# EAGLE schematic vref low current 20 vpp source v01 (EAGLE 7.7.0)
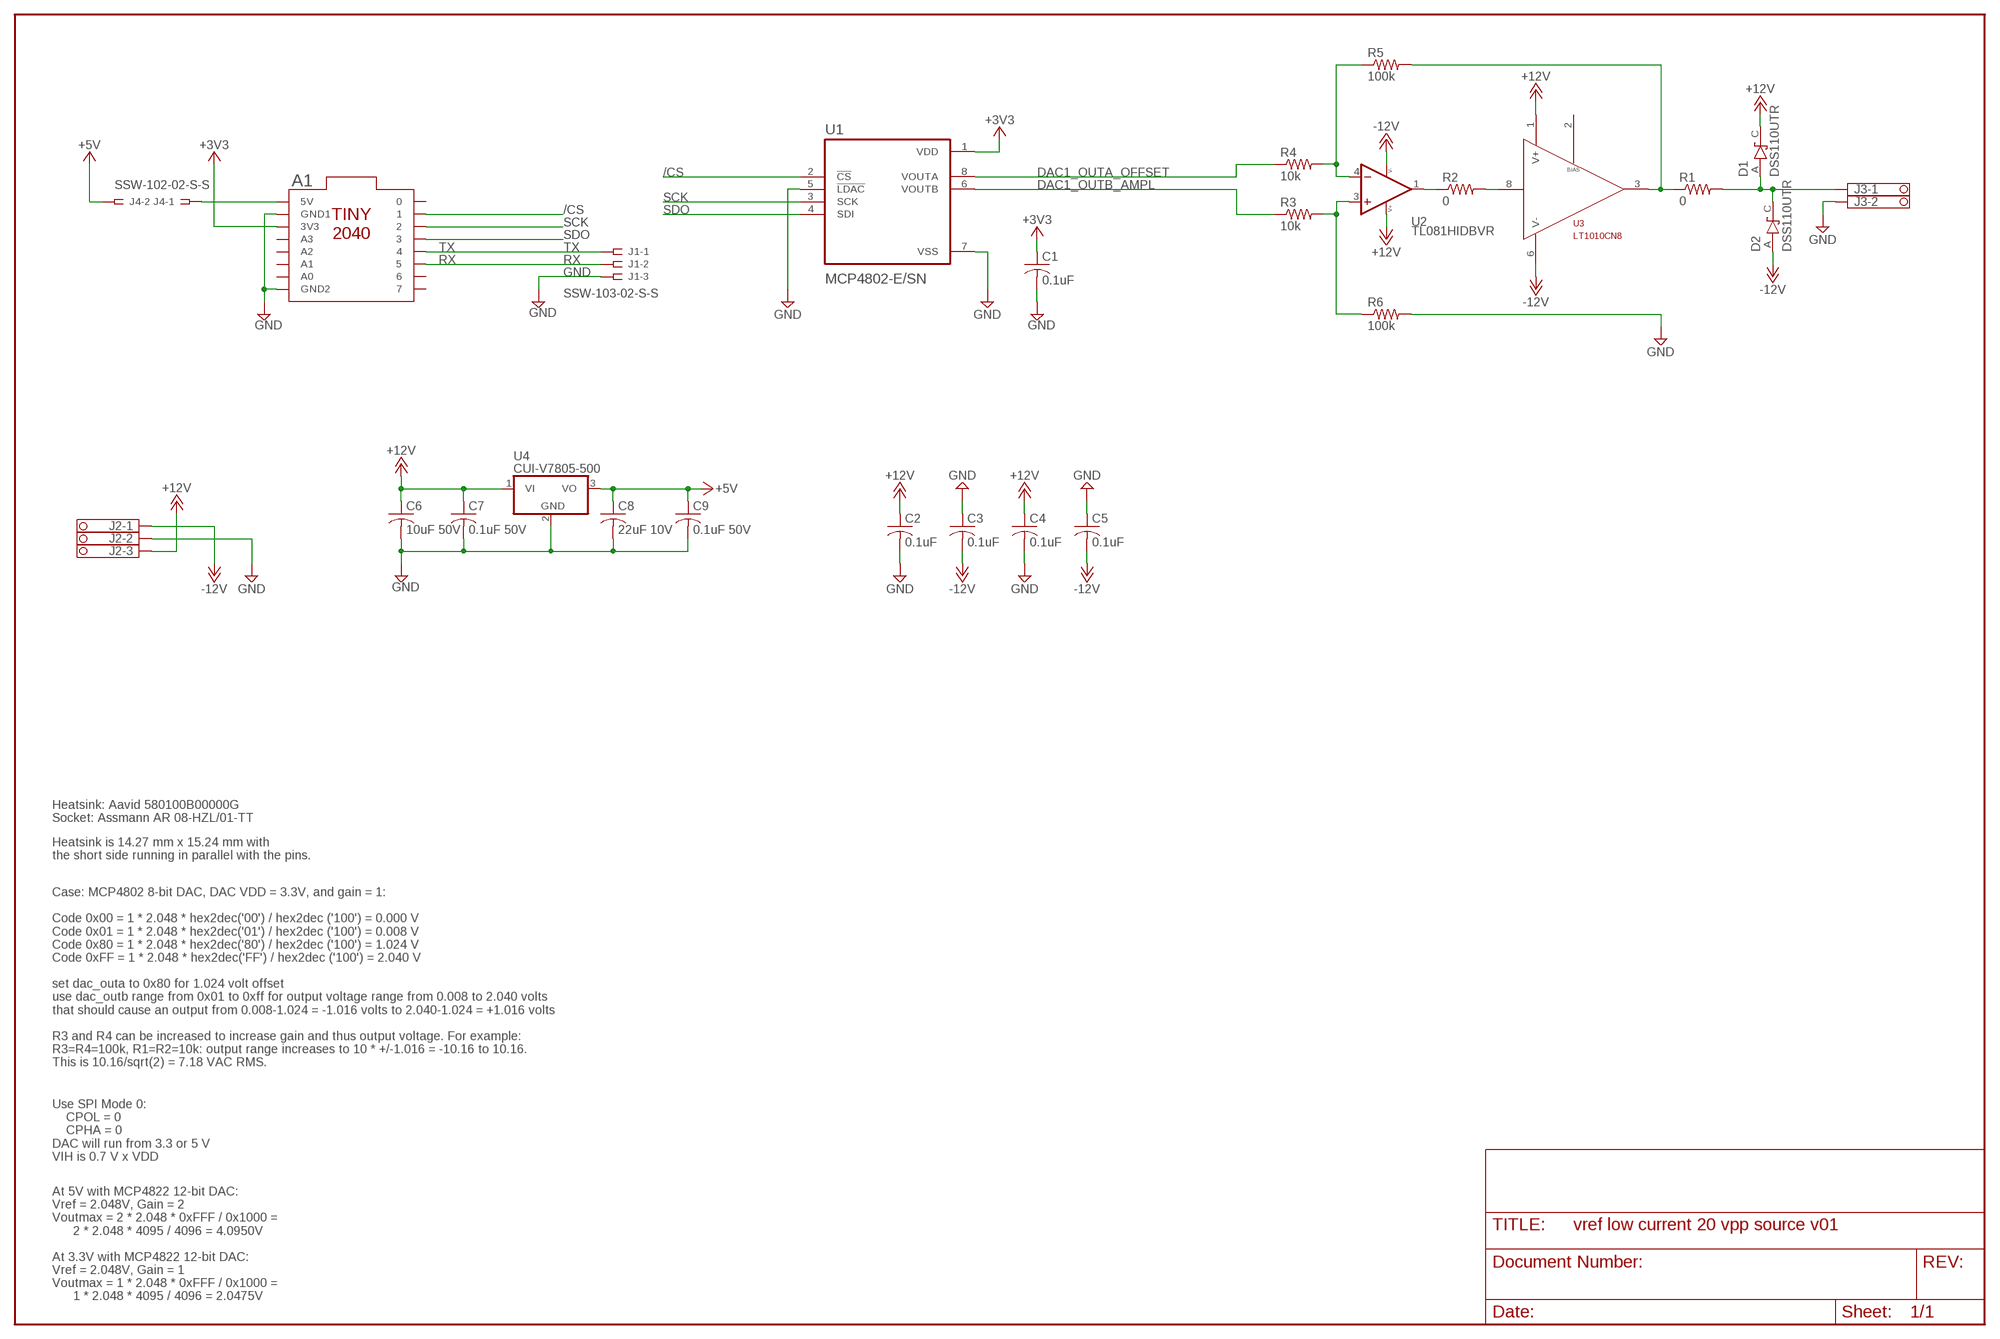
[diagram p0: schematic, sheet 1]

## Parts
A1  TINY2040PTHLOCK  [TINY2040_PTH_LOCK]
C1  0.1uF  C-USC0603K  [C0603K]
C2  0.1uF  C-USC0603K  [C0603K]
C3  0.1uF  C-USC0603K  [C0603K]
C4  0.1uF  C-USC0603K  [C0603K]
C5  0.1uF  C-USC0603K  [C0603K]
C6  10uF 50V  C-USC1210K  [C1210K]
C7  0.1uF 50V  C-USC1206K  [C1206K]
C8  22uF 10V  C-USC1206K  [C1206K]
C9  0.1uF 50V  C-USC1206K  [C1206K]
D1  DSS110UTR  [SODFL3618X110N]
D2  DSS110UTR  [SODFL3618X110N]
J1  SSW-103-02-S-S  [SSW-103-02-S-S]
J2  1751251  [1751251]
J3  1751248  [1751248]
J4  SSW-102-02-S-S  [SSW-102-02-S-S]
R1  0  R-US_R1206  [R1206]
R2  0  R-US_R1206  [R1206]
R3  10k  R-US_R1206  [R1206]
R4  10k  R-US_R1206  [R1206]
R5  100k  R-US_R1206  [R1206]
R6  100k  R-US_R1206  [R1206]
U1  MCP4802-E/SN  [SOIC127P600X175-8N]
U2  TL081HIDBVR  [SOT-23-5_DBV_TEX]
U3  LT1010CN8  [DIL08]
U4  CUI-V7805-500  CUI-V7803-500  [CUI-78XX-500]

## Nets
+: R3.2 R6.1 U2.3(IN+)
+3V3: A1.3V3 C1.1 U1.1(VDD)
+5V: C8.1 C9.1 J4.2 U4.3(VO)
+12V: C2.1 C4.1 C6.1 C7.1 D1.C(K) J2.3 U2.5(V+) U3.1(V+) U4.1(VI)
-: R4.2 R5.1 U2.4(IN-)
-12V: C3.2 C5.2 D2.A J2.1 U2.2(V-) U3.6(V-)
/CS: A1.1 U1.2(!CS)
DAC1_OUTA_OFFSET: R4.1 U1.8(VOUTA)
DAC1_OUTB_AMPL: R3.1 U1.6(VOUTB)
GND: A1.GND1 A1.GND2 C1.2 C2.2 C3.1 C4.2 C5.1 C6.2 C7.2 C8.2 C9.2 J1.3 J2.2 J3.2 R6.2 U1.5(!LDAC) U1.7(VSS) U4.2(GND)
N$1: R2.1 U2.1(OUT)
N$2: D1.A D2.C(K) J3.1 R1.2
N$3: A1.5V J4.1
N$4: R2.2 U3.8(INPUT)
OUT: R1.1 R5.2 U3.3(OUTPUT)
RX: A1.5 J1.2
SCK: A1.2 U1.3(SCK)
SDO: A1.3 U1.4(SDI)
TX: A1.4 J1.1
Unconnected: A1.0 A1.6 A1.7 A1.A0 A1.A1 A1.A2 A1.A3 U3.2(BIAS)

## Notes on the sheet
- Heatsink: Aavid 580100B00000G
  Socket: Assmann AR 08-HZL/01-TT
- Heatsink is 14.27 mm x 15.24 mm with
  the short side running in parallel with the pins.
- Case: MCP4802 8-bit DAC, DAC VDD = 3.3V, and gain = 1:
  
  Code 0x00 = 1 * 2.048 * hex2dec('00') / hex2dec ('100') = 0.000 V
  Code 0x01 = 1 * 2.048 * hex2dec('01') / hex2dec ('100') = 0.008 V
  Code 0x80 = 1 * 2.048 * hex2dec('80') / hex2dec ('100') = 1.024 V
  Code 0xFF = 1 * 2.048 * hex2dec('FF') / hex2dec ('100') = 2.040 V
  
  set dac_outa to 0x80 for 1.024 volt offset
  use dac_outb range from 0x01 to 0xff for output voltage range from 0.008 to 2.040 volts
  that should cause an output from 0.008-1.024 = -1.016 volts to 2.040-1.024 = +1.016 volts
  
  R3 and R4 can be increased to increase gain and thus output voltage. For example:
  R3=R4=100k, R1=R2=10k: output range increases to 10 * +/-1.016 = -10.16 to 10.16. 
  This is 10.16/sqrt(2) = 7.18 VAC RMS.
- Use SPI Mode 0:
      CPOL = 0
      CPHA = 0
  DAC will run from 3.3 or 5 V
  VIH is 0.7 V x VDD
- At 5V with MCP4822 12-bit DAC:
  Vref = 2.048V, Gain = 2
  Voutmax = 2 * 2.048 * 0xFFF / 0x1000 = 
        2 * 2.048 * 4095 / 4096 = 4.0950V
  
  At 3.3V with MCP4822 12-bit DAC:
  Vref = 2.048V, Gain = 1
  Voutmax = 1 * 2.048 * 0xFFF / 0x1000 = 
        1 * 2.048 * 4095 / 4096 = 2.0475V

## Library data of the parts
A1 = pimoroni-boards:TINY2040PTH
C1-C5 = rcl:C-US: CAPACITOR, American symbol; MFR: KEMET; MFR_PART_NO: C1206C104K5RACAUTO
C6 = rcl:C-US: CAPACITOR, American symbol; MFR: KEMET; MFR_PART_NO: C1210C106K5RACTU
C7 C9 = rcl:C-US: CAPACITOR, American symbol; MFR: KEMET; MFR_PART_NO: C1206S104M5RACTU
C8 = rcl:C-US: CAPACITOR, American symbol; MFR: KEMET; MFR_PART_NO: C1206C226K8RAC7800
D1 D2 = DSS110UTR:DSS110UTR: Check availability <https://pricing.snapeda.com/parts/DSS110UTR/SMC%20Diode%20Solutions/view-part?ref=eda> Check availability <https://pricing.snapeda.com/parts/DSS110UTR/SMC%20Diode%20Solutions/view-part?ref=eda>; DESCRIPTION: Diode Schottky 100 V 1A Surface Mount SOD-123FL; MF: SMC Diode Solutions; MP: DSS110UTR; PACKAGE: SOD-123F SMC Diode Solutions; PURCHASE-URL: https://pricing.snapeda.com/search/part/DSS110UTR/?ref=eda
J1 = con-samtec:SSW-103-02-S-S: THROUGH-HOLE .025" SQ POST SOCKET Source: Samtec SSW.pdf; MPN: SSW-103-02-S-S; OC_FARNELL: unknown; OC_NEWARK: 11P9367
J2 = con-phoenix-350:1751251: MKDS 1/ 3-3,5 Printklemme Nennstrom: 10 A Bemessungsspannung: 160 V Raster: 3,5 mm Polzahl: 3 Montageart: Löten Anschlussart: Schraubanschluss Anschlussrichtung vom Leiter zur Platine: 0° Source: http://eshop.phoenixcontact.com .. 1751251.pdf; OC_FARNELL: unknown; OC_NEWARK: unknown
J3 = con-phoenix-350:1751248: MKDS 1/ 2-3,5 Printklemme Nennstrom: 10 A Bemessungsspannung: 160 V Raster: 3,5 mm Polzahl: 2 Montageart: Löten Anschlussart: Schraubanschluss Anschlussrichtung vom Leiter zur Platine: 0° Source: http://eshop.phoenixcontact.com .. 1751248.pdf; OC_FARNELL: unknown; OC_NEWARK: unknown
J4 = con-samtec:SSW-102-02-S-S: THROUGH-HOLE .025" SQ POST SOCKET Source: Samtec SSW.pdf; MPN: SSW-102-02-S-S; OC_FARNELL: unknown; OC_NEWARK: 11P9351
R1-R6 = rcl:R-US_: RESISTOR, American symbol
U1 = MCP4802-E_SN:MCP4802-E/SN; DESCRIPTION: DAC 2-CH Resistor-String 8-bit Automotive 8-Pin SOIC N Tube; DIGI-KEY_PART_NUMBER: MCP4802-E/SN-ND; MF: Microchip Technology; MP: MCP4802-E/SN; PACKAGE: SOIC-8 Microchip Technology; PURCHASE-URL: https://pricing.snapeda.com/search/part/MCP4802-E/SN/?ref=eda
U2 = ul_TL081HIDBVR:TL081HIDBVR; COPYRIGHT: Copyright (C) 2022 Ultra Librarian. All rights reserved.; DIGI-KEY_PART_NUMBER_1: 296-TL081HIDBVRTR-ND; DIGI-KEY_PART_NUMBER_2: 296-TL081HIDBVRCT-ND; DIGI-KEY_PART_NUMBER_3: 296-TL081HIDBVRDKR-ND; MANUFACTURER_PART_NUMBER: TL081HIDBVR; MFR_NAME: Texas Instruments
U3 = GlenPartsLibrary:LT1010CN8
U4 = GlenPartsLibrary:CUI-V7803-500